# Altium project USB_EMMC.PrjPcb
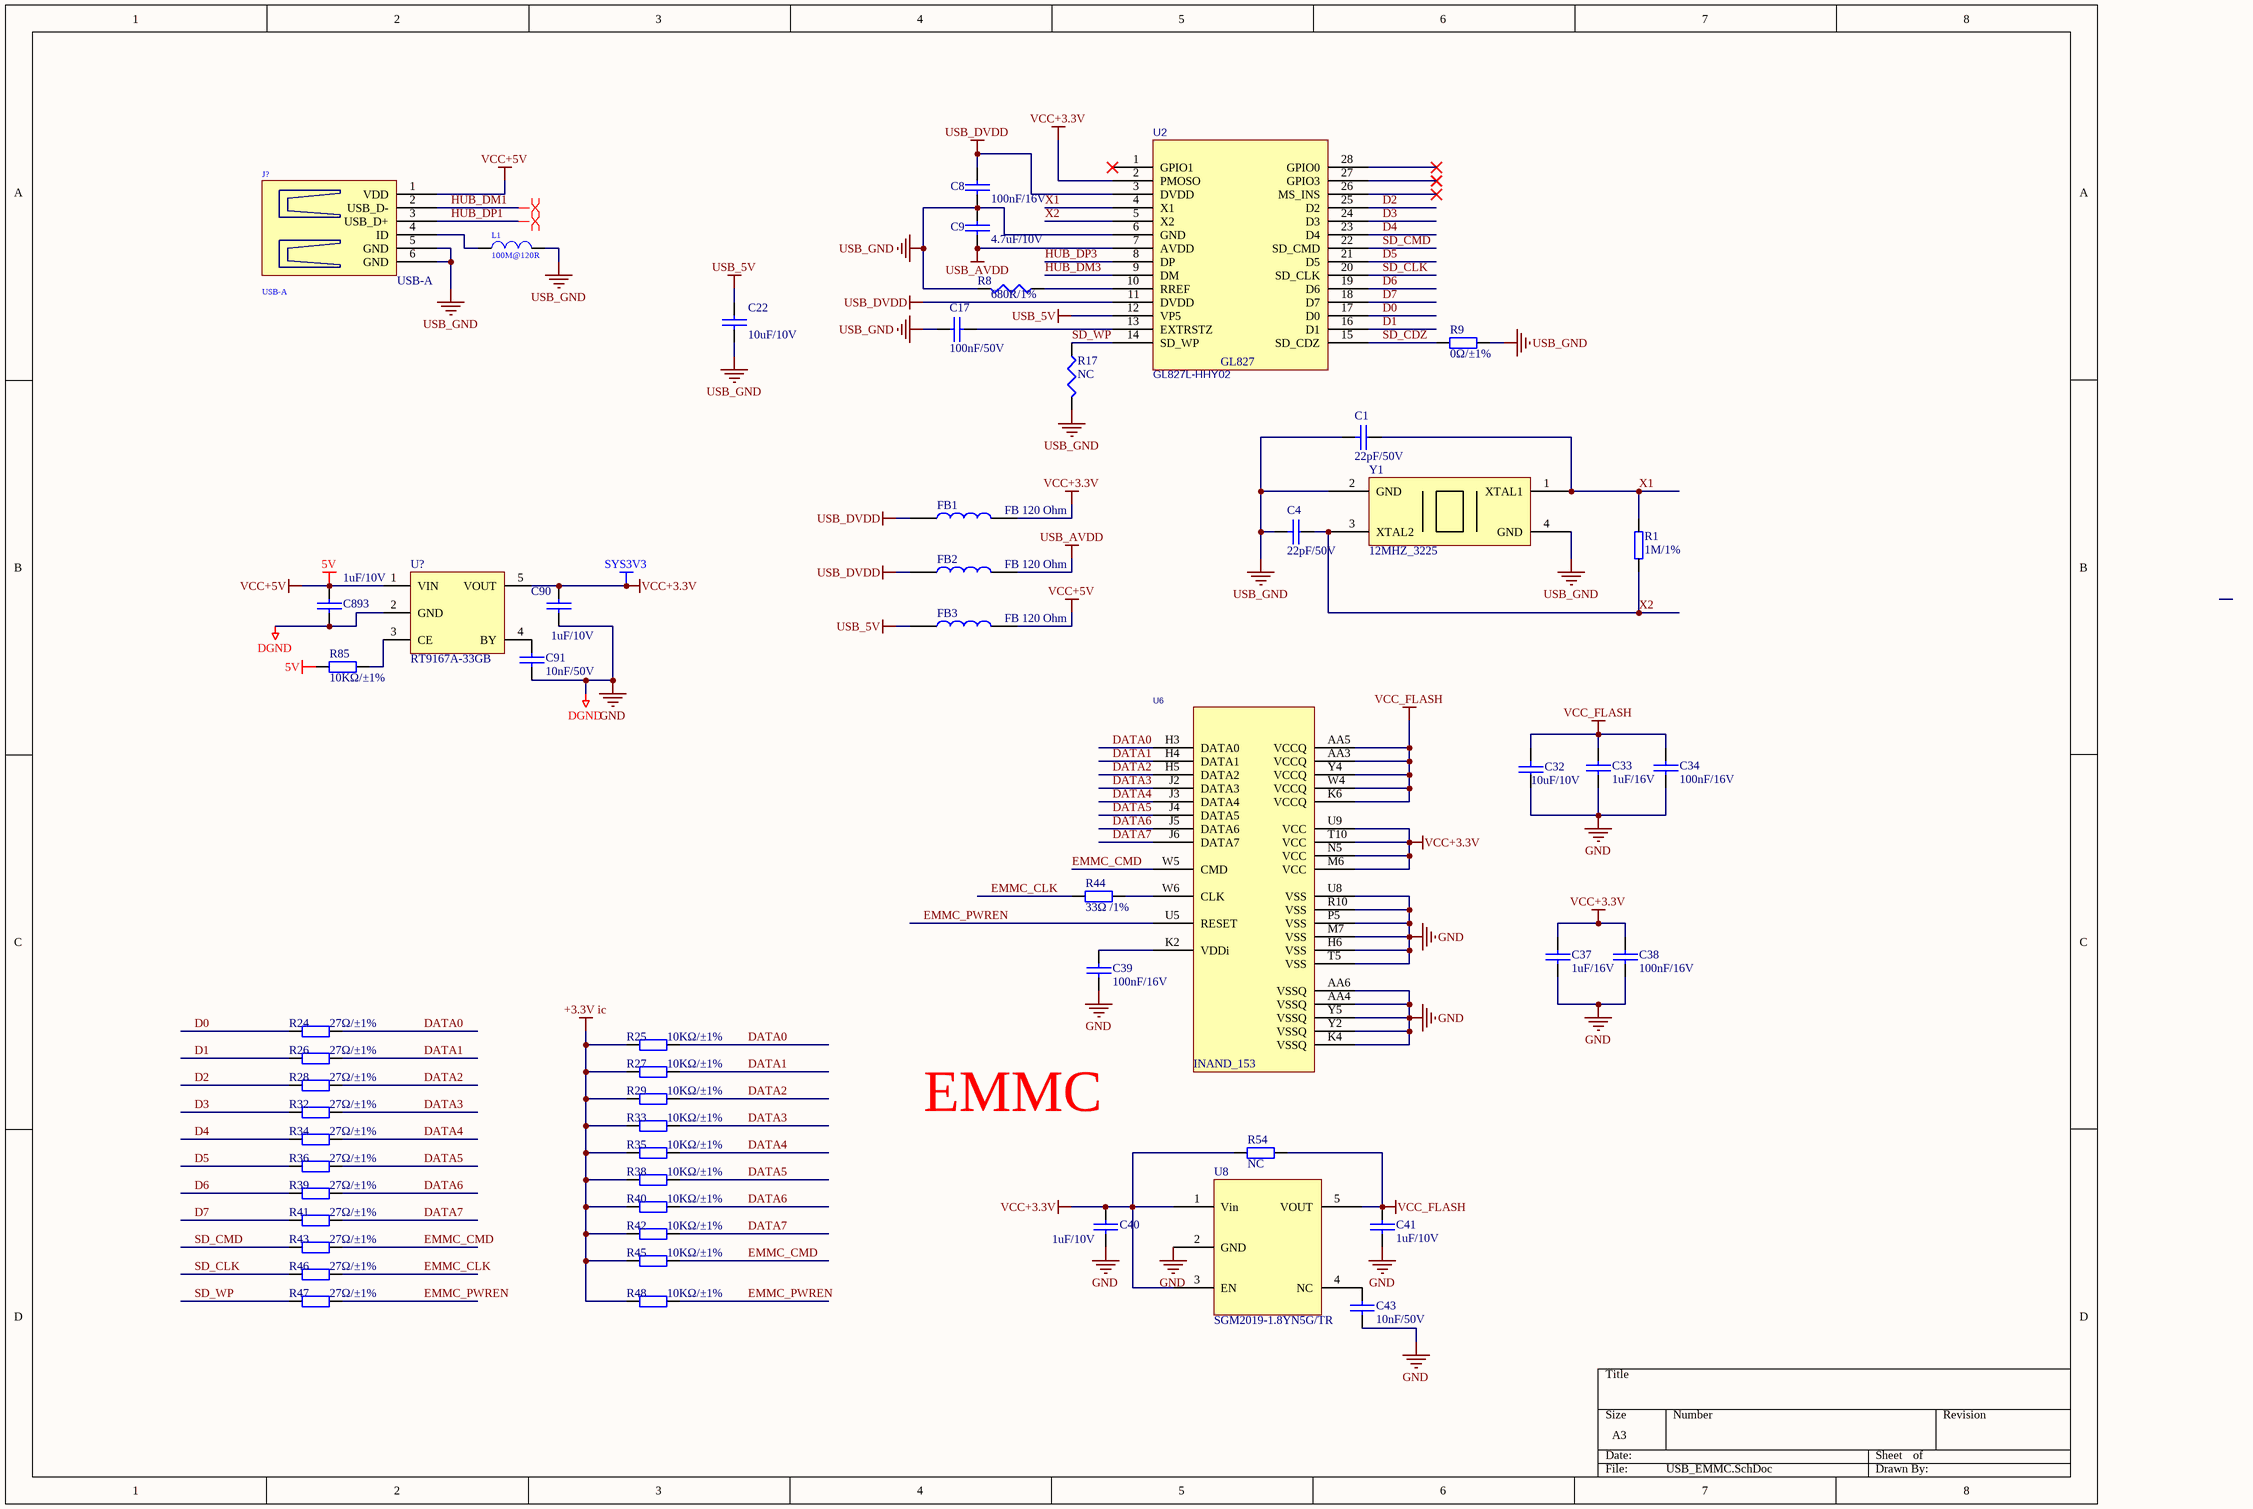
[diagram p0: USB_EMMC.SchDoc]
1 sheet, 56 parts. Net scope: global (net labels, ports and power ports of the same name join across sheets).
Board file: USB_EMMC.PcbDoc

## Sheet USB_EMMC.SchDoc
size A3

### Parts
C1  22pF/50V  [0402_C]
C4  22pF/50V  [0402_C]
C8  100nF/16V  [0402_C]
C9  4.7uF/10V  [0402_C]
C17  100nF/50V  [0402_C]
C22  10uF/10V  [0402_C]
C32  10uF/10V  [0402_C]
C33  1uF/16V  [0402_C]
C34  100nF/16V  [0402_C]
C37  1uF/16V  [0402_C]
C38  100nF/16V  [0402_C]
C39  100nF/16V  [0402_C]
C40  1uF/10V  [0402_C]
C41  1uF/10V  [0402_C]
C43  10nF/50V  [0402_C]
C90  1uF/10V  [0402_C]
C91  10nF/50V  [0402_C]
C893  1uF/10V  [0402_C]
FB1  FB 120 Ohm  [0402_L]
FB2  FB 120 Ohm  [0402_L]
FB3  FB 120 Ohm  [0402_L]
J?  USB-A  [USB-2.0-4P-18.8X12.0-H4.5-XKB]
L1  100M@120R  [0805]
R1  1M/1%  [0402_R]
R8  680R/1%  [0402_R]
R9  0Ω/±1%  [0402_R]
R17  NC  [0402_R]
R24  27Ω/±1%  [0402_R]
R25  10KΩ/±1%  [0402_R]
R26  27Ω/±1%  [0402_R]
R27  10KΩ/±1%  [0402_R]
R28  27Ω/±1%  [0402_R]
R29  10KΩ/±1%  [0402_R]
R32  27Ω/±1%  [0402_R]
R33  10KΩ/±1%  [0402_R]
R34  27Ω/±1%  [0402_R]
R35  10KΩ/±1%  [0402_R]
R36  27Ω/±1%  [0402_R]
R38  10KΩ/±1%  [0402_R]
R39  27Ω/±1%  [0402_R]
R40  10KΩ/±1%  [0402_R]
R41  27Ω/±1%  [0402_R]
R42  10KΩ/±1%  [0402_R]
R43  27Ω/±1%  [0402_R]
R44  33Ω /1%  [0402_R]
R45  10KΩ/±1%  [0402_R]
R46  27Ω/±1%  [0402_R]
R47  27Ω/±1%  [0402_R]
R48  10KΩ/±1%  [0402_R]
R54  NC  [0402_R]
R85  10KΩ/±1%  [0402_R]
U1  RT9167A-33GB  [SOT-23-5]
U2  GL827L-HHY02  [SSOP-28_150MIL]
U6  THGBMHG6C1LBAIL  [IC-BGA153-SDIN8DE1-8G-C - duplicate]  (value not drawn)
U8  SGM2019-1.8YN5G/TR  [SOT-23-5]
Y1  12MHZ_3225  [SMD_XTAL_3225]

### Nets
5V: C893.1 FB3.2 J?.1(VDD) R85.1 U1.1(VIN)  [also labelled VCC+5V]
+3.3V ic: R25.1 R27.1 R29.1 R33.1 R35.1 R38.1 R40.1 R42.1 R45.1 R48.1
DGND: C32.2 C33.1 C34.2 C37.1 C38.2 C39.2 C40.2 C41.2 C43.2 C90.2 C91.2 C893.2 U1.2(GND) U6.AA4(VSSQ) U6.AA6(VSSQ) U6.H6(VSS) U6.K4(VSSQ) U6.M7(VSS) U6.P5(VSS) U6.R10(VSS) U6.T5(VSS) U6.U8(VSS) U6.Y2(VSSQ) U6.Y5(VSSQ) U8.2(GND)  [also labelled GND]
SYS3V3: C37.2 C38.1 C40.1 C90.1 FB1.2 R54.1 U1.5(VOUT) U2.2(PMOSO) U6.M6(VCC) U6.N5(VCC) U6.T10(VCC) U6.U9(VCC) U8.1(Vin) U8.3(EN)  [also labelled VCC+3.3V]
USB_5V: C22.1 FB3.1 U2.12(VP5)
USB_AVDD: C9.1 FB2.2 U2.7(AVDD)
USB_DVDD: C8.2 FB1.1 FB2.1 U2.3(DVDD) U2.11(DVDD)
USB_GND: C1.1 C4.1 C8.1 C9.2 C17.2 C22.2 J?.5(GND) J?.6(GND) L1.2 R8.2 R9.1 R17.2 U2.6(GND) Y1.2(GND) Y1.4(GND)
VCC_FLASH: C32.1 C33.2 C34.1 C41.1 R54.2 U6.AA3(VCCQ) U6.AA5(VCCQ) U6.K6(VCCQ) U6.W4(VCCQ) U6.Y4(VCCQ) U8.5(VOUT)
D0: R24.1 U2.17(D0)
D1: R26.1 U2.16(D1)
D2: R28.1 U2.25(D2)
D3: R32.1 U2.24(D3)
D4: R34.1 U2.23(D4)
D5: R36.1 U2.21(D5)
D6: R39.1 U2.19(D6)
D7: R41.1 U2.18(D7)
DATA0: R24.2 R25.2 U6.H3(DATA0)
DATA1: R26.2 R27.2 U6.H4(DATA1)
DATA2: R28.2 R29.2 U6.H5(DATA2)
DATA3: R32.2 R33.2 U6.J2(DATA3)
DATA4: R34.2 R35.2 U6.J3(DATA4)
DATA5: R36.2 R38.2 U6.J4(DATA5)
DATA6: R39.2 R40.2 U6.J5(DATA6)
DATA7: R41.2 R42.2 U6.J6(DATA7)
EMMC_CLK: R44.1 R46.2
EMMC_CMD: R43.2 R45.2 U6.W5(CMD)
EMMC_PWREN: R47.2 R48.2 U6.U5(RESET)
HUB_DM1: J?.2(USB_D-)
HUB_DM3: U2.9(DM)
HUB_DP1: J?.3(USB_D+)
HUB_DP3: U2.8(DP)
SD_CDZ: R9.2 U2.15(SD_CDZ)
SD_CLK: R46.1 U2.20(SD_CLK)
SD_CMD: R43.1 U2.22(SD_CMD)
SD_WP: R17.1 R47.1 U2.14(SD_WP)
X1: C1.2 R1.1 U2.4(X1) Y1.1(XTAL1)
X2: C4.2 R1.2 U2.5(X2) Y1.3(XTAL2)
NetC17_1: C17.1 U2.13(EXTRSTZ)
NetC39_1: C39.1 U6.K2(VDDi)
NetC43_1: C43.1 U8.4(NC)
NetC91_1: C91.1 U1.4(BY)
NetJ?_4: J?.4(ID) L1.1
NetR8_1: R8.1 U2.10(RREF)
NetR44_2: R44.2 U6.W6(CLK)
NetR85_2: R85.2 U1.3(CE)

Not connected (* = marked no-connect by the designer): U2 1(GPIO1)* 26(MS_INS)* 27(GPIO3)* 28(GPIO0)*

### Layout directives
differential pair: HUB_DM1, HUB_DP1

### Notes on the sheet
- EMMC
- (in symbol GL827L-HHY02) GL827
- (in symbol KLMAG4FE4B-B002_0) INAND_153

### Library data of the parts
C1 C4 = C2: 22pF/50V;0402
C8 C34 C38 C39 = CAP: 100nF±10%/16V，X7R，MLCC，-55°C ~ 125°C，0402; 参考链接: https://item.szlcsc.com/78132.html
C9 = CAP: 4.7uF±20%/10V，X5R，0402; 参考链接: https://item.szlcsc.com/313626.html
C17 = CAP: 100nF/50V;X7R;0402;
C22 = CAP: 10uF/10V;X5R;0402;
C32 = C2: 10uF/10V;0402
C33 C37 = CAP: 1uF±10%/10V，X5R，0402; 参考链接: https://item.szlcsc.com/78133.html
C40 C41 = CAP: 1uF/10V;X5R;10%;0402;
C43 C91 = CAP: 10nF/50V;X7R;0402;
C90 C893 = CAP: 1uF/10V;X5R;0402;
FB1-FB3 = INDUCTOR1: FB120 Ohm/1%;0402;
J? = CON6: Connector; Part_Field_Name_1: Part Field 1; Part_Field_Name_10: Part Field 10; Part_Field_Name_11: Part Field 11; Part_Field_Name_2: Part Field 2; Part_Field_Name_3: Part Field 3; Part_Field_Name_4: Part Field 4; Part_Field_Name_5: Part Field 5; Part_Field_Name_6: Part Field 6; Part_Field_Name_7: Part Field 7; Part_Field_Name_8: Part Field 8; Part_Field_Name_9: Part Field 9; Part_Field_Name_12: Part Field 12; Part_Field_Name_13: Part Field 13; Part_Field_Name_14: Part Field 14
L1 = L: Part_Field_Name_1: Part Field 1; Part_Field_Name_10: Part Field 10; Part_Field_Name_11: Part Field 11; Part_Field_Name_2: Part Field 2; Part_Field_Name_3: Part Field 3; Part_Field_Name_4: Part Field 4; Part_Field_Name_5: Part Field 5; Part_Field_Name_6: Part Field 6; Part_Field_Name_7: Part Field 7; Part_Field_Name_8: Part Field 8; Part_Field_Name_9: Part Field 9; Part_Field_Name_12: Part Field 12; Part_Field_Name_13: Part Field 13; Part_Field_Name_14: Part Field 14; Part_Field_Name_15: Part Field 15; VALUE: 100M@120R
R1 = R: 1M/1%;0402
R8 = RES1: 680R/1%;0402;
R9 R24 R26 R28 R32 R34 R36 R39 R41 R43 R46 R47 = 0603 27Ω (27R0) 1%: 贴片电阻; ComponentLink1Description: 供应商链接; ComponentLink1URL: http://www.szlcsc.com/product/details_25933.html; Package: 0603; Supplier: LC; SuppliersPartNumber: C25190
R17 = RES1: 10K/1%;0402;
R25 R27 R29 R33 R35 R38 R40 R42 R45 R48 R85 = 0402 10KΩ (1002) 1%: 贴片电阻; ComponentLink1Description: 供应商链接; ComponentLink1URL: http://www.szlcsc.com/product/details_26487.html; Package: 0402; Supplier: LC; SuppliersPartNumber: C25744
R44 R54 = 0402 33Ω (33R0) 1%: 贴片电阻; ComponentLink1Description: 供应商链接; ComponentLink1URL: http://www.szlcsc.com/product/details_25848.html; Package: 0402; Supplier: LC; SuppliersPartNumber: C25105
U1 = RT9167: RT9167A-33GB;SOT23-5;RICHTEK; LDO
U2 = GL827L-HHY02: BOM_Manufacturer: Genesys Logic; Contributor: LCSC; BOM_Supplier: LCSC; BOM_Supplier Part: C161839; BOM_Manufacturer Part: GL827L-HHY02; spicePre: U
U6 = KLMAG4FE4B-B002_0: KLM8G2FEJA-A002; PCB DECAL: IC-BGA169-SDIN8DE1-8G-C; Source_Path: Z:\003_NXP4330\002_HW\002_REFERENCE_BOARD\001_SCHEMATIC\001_DEVELOP\NXP4330_TABLET_REF_VER090_130401-1.DSN
U8 = XC6219B182MR: XC6219B182MR;SOT23-5;TOREX;
Y1 = 12MHZ_3225: XTAL;12MHZ_3225;Crystals